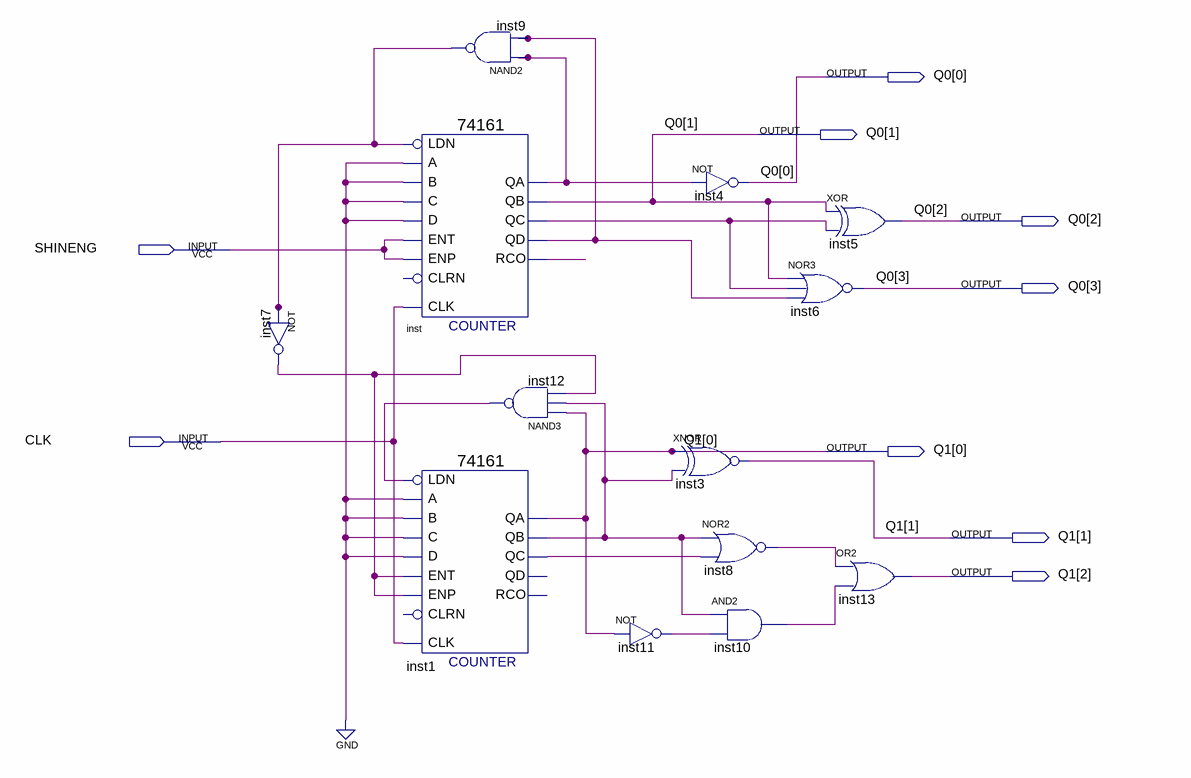
[diagram p0: schematic sheet]
// Quartus schematic red.bdf as structural Verilog: 13 symbols, 9 pins
module red (
  input  SHINENG,
  input  CLK,
  output [3:0] Q0,
  output [2:0] Q1
);

  wire inst1_qb, inst1_qc, inst7_out, inst8_out, inst9_out, inst10_out, inst11_out, inst12_out, inst_qa,
       inst_qc, inst_qd, inst_rco;

  not inst7 (inst7_out, inst9_out);
  \74161  inst (
    .CLK(CLK), .ENP(SHINENG), .LDN(inst9_out), .A(1'b0), .D(1'b0), .ENT(SHINENG), .B(1'b0), .C(1'b0),
    .QD(inst_qd), .QC(inst_qc), .QB(Q0[1]), .QA(inst_qa), .RCO(inst_rco));  // open: CLRN
  \74161  inst1 (
    .CLK(CLK), .ENP(inst7_out), .LDN(inst12_out), .A(1'b0), .D(1'b0), .ENT(inst7_out), .B(1'b0), .C(1'b0),
    .QC(inst1_qc), .QB(inst1_qb), .QA(Q1[0]));  // open: CLRN, QD, RCO
  nand inst9 (inst9_out, inst_qa, inst_qd);
  nand inst12 (inst12_out, Q1[0], inst1_qb, inst7_out);
  not inst11 (inst11_out, Q1[0]);
  not inst4 (Q0[0], inst_qa);
  xnor inst3 (Q1[1], Q1[0], inst1_qb);
  nor inst8 (inst8_out, inst1_qb, inst1_qc);
  and inst10 (inst10_out, inst1_qb, inst11_out);
  nor inst6 (Q0[3], Q0[1], inst_qc, inst_qd);
  xor inst5 (Q0[2], Q0[1], inst_qc);
  or inst13 (Q1[2], inst8_out, inst10_out);
endmodule
